# Altium schematic sheet ASIB.SchDoc
size A; SheetNumber: 2; SheetTotal: 4
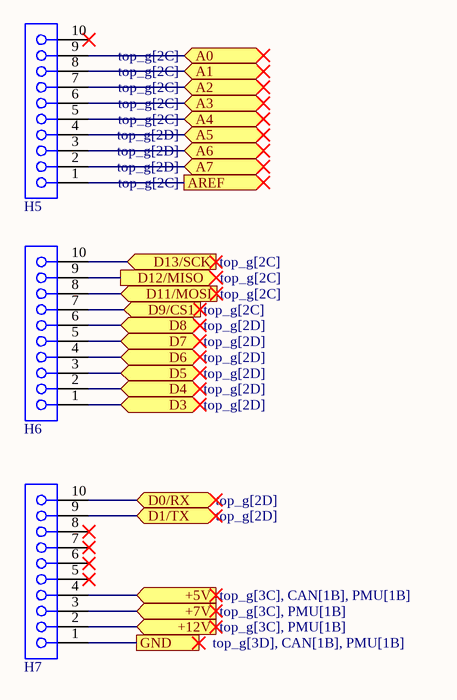
[diagram p0: ASIB.SchDoc]

## Parts
H5  61301011821  [61301011821]  (value not drawn)
H6  61301011821  [61301011821]  (value not drawn)
H7  61301011821  [61301011821]  (value not drawn)

## Ports
+5V (in, see top_g[3C], CAN[1B], PMU[1B]), +7V (in, see top_g[3C], PMU[1B]), +12V (in, see top_g[3C], PMU[1B]), A0 (bidir, see top_g[2C]), A1 (bidir, see top_g[2C]), A2 (bidir, see top_g[2C]), A3 (bidir, see top_g[2C]), A4 (bidir, see top_g[2C]), A5 (bidir, see top_g[2D]), A6 (bidir, see top_g[2D]), A7 (bidir, see top_g[2D]), AREF (out, see top_g[2C]), D0/RX (bidir, see top_g[2D]), D1/TX (bidir, see top_g[2D]), D3 (bidir, see top_g[2D]), D4 (bidir, see top_g[2D]), D5 (bidir, see top_g[2D]), D6 (bidir, see top_g[2D]), D7 (bidir, see top_g[2D]), D8 (bidir, see top_g[2D]), D9/CS1 (in, see top_g[2C]), D11/MOSI (in, see top_g[2C]), D12/MISO (out, see top_g[2C]), D13/SCK (in, see top_g[2C]), GND (see top_g[3D], CAN[1B], PMU[1B])

## Nets
+5V: H7.4 ; port +5V
+7V: H7.3 ; port +7V
+12V: H7.2 ; port +12V
A0: H5.9 ; port A0
A1: H5.8 ; port A1
A2: H5.7 ; port A2
A3: H5.6 ; port A3
A4: H5.5 ; port A4
A5: H5.4 ; port A5
A6: H5.3 ; port A6
A7: H5.2 ; port A7
AREF: H5.1 ; port AREF
D0/RX: H7.10 ; port D0/RX
D1/TX: H7.9 ; port D1/TX
D3: H6.1 ; port D3
D4: H6.2 ; port D4
D5: H6.3 ; port D5
D6: H6.4 ; port D6
D7: H6.5 ; port D7
D8: H6.6 ; port D8
D9/CS1: H6.7 ; port D9/CS1
D11/MOSI: H6.8 ; port D11/MOSI
D12/MISO: H6.9 ; port D12/MISO
D13/SCK: H6.10 ; port D13/SCK
GND: H7.1 ; port GND

Not connected (* = marked no-connect by the designer): H5 10*; H7 5* 6* 7* 8*

## Library data of the parts
H5-H7 = 61301011821: WR-PHD Socket Header, THT, Vertical, pitch 2.54mm, 1 Row, 10P; Manufacturer: Wurth Elektronik; Contact Resistance: 20mOhm; Rated Current: 3A; Working Voltage: 250V; Withstanding Voltage: 500V; Manufacturer Part Number: 61301011821; Category: Board-to-Board Connectors; Match Code: WR-PHD; ComponentLink1Description: Website Link; ComponentLink1URL: https://www.we-online.com/redexpert/article/61301011821?ad; ComponentLink2Description: Datasheet Link; ComponentLink2URL: https://www.we-online.com/redexpert/spec/61301011821?ad; Mount: Through Hole; Operating Temperature Max: 105°C; Operating Temperature Min: -40°C; Packaging: Tray; Gender: Socket Header; Number of Pins: 10; Number of Rows: 1; Orientation: Vertical; Pitch: 2.54mm